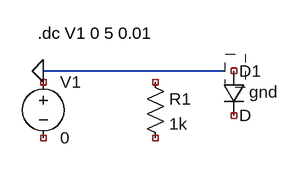
[diagram p0: schematic diode_iv_schematic (1).asc]
diode_iv_schematic (1).asc, the LTspice schematic file:
Version 4
SHEET 1 880 680
WIRE 96 64 48 64
WIRE 192 64 96 64
WIRE 304 64 192 64
FLAG 48 64 0
SYMBOL voltage 48 64 R0
SYMATTR InstName V1
SYMATTR Value 0
SYMBOL res 192 64 R0
SYMATTR InstName R1
SYMATTR Value 1k
SYMBOL diode 304 64 R0
SYMATTR InstName D1
SYMBOL gnd 48 96 R0
TEXT 40 10 Left 2 !.dc V1 0 5 0.01

The netlist it stands for:
* diode_iv_schematic (1).asc
V1 NC_01 NC_02 0
R1 NC_03 NC_04 1k
D1 NC_05 NC_06 D
* ?: gnd (symbol gnd not available, pin order unknown); nets seen at it: 0
.model D D
.lib standard.dio
.dc V1 0 5 0.01
.backanno
.end